# EasyEDA Pro project IronBen_核心板.epro

# Schematic Schematic2
Board Name: 笨笨专用; Create Date: 2025-01-12; Page Name: P1; Project Name: STM32F407VET6; Schematic Name: Schematic2; Update Date: 2025-06-20; Company: 嘉立创EDA; Page Size: A4; Version: V1.0
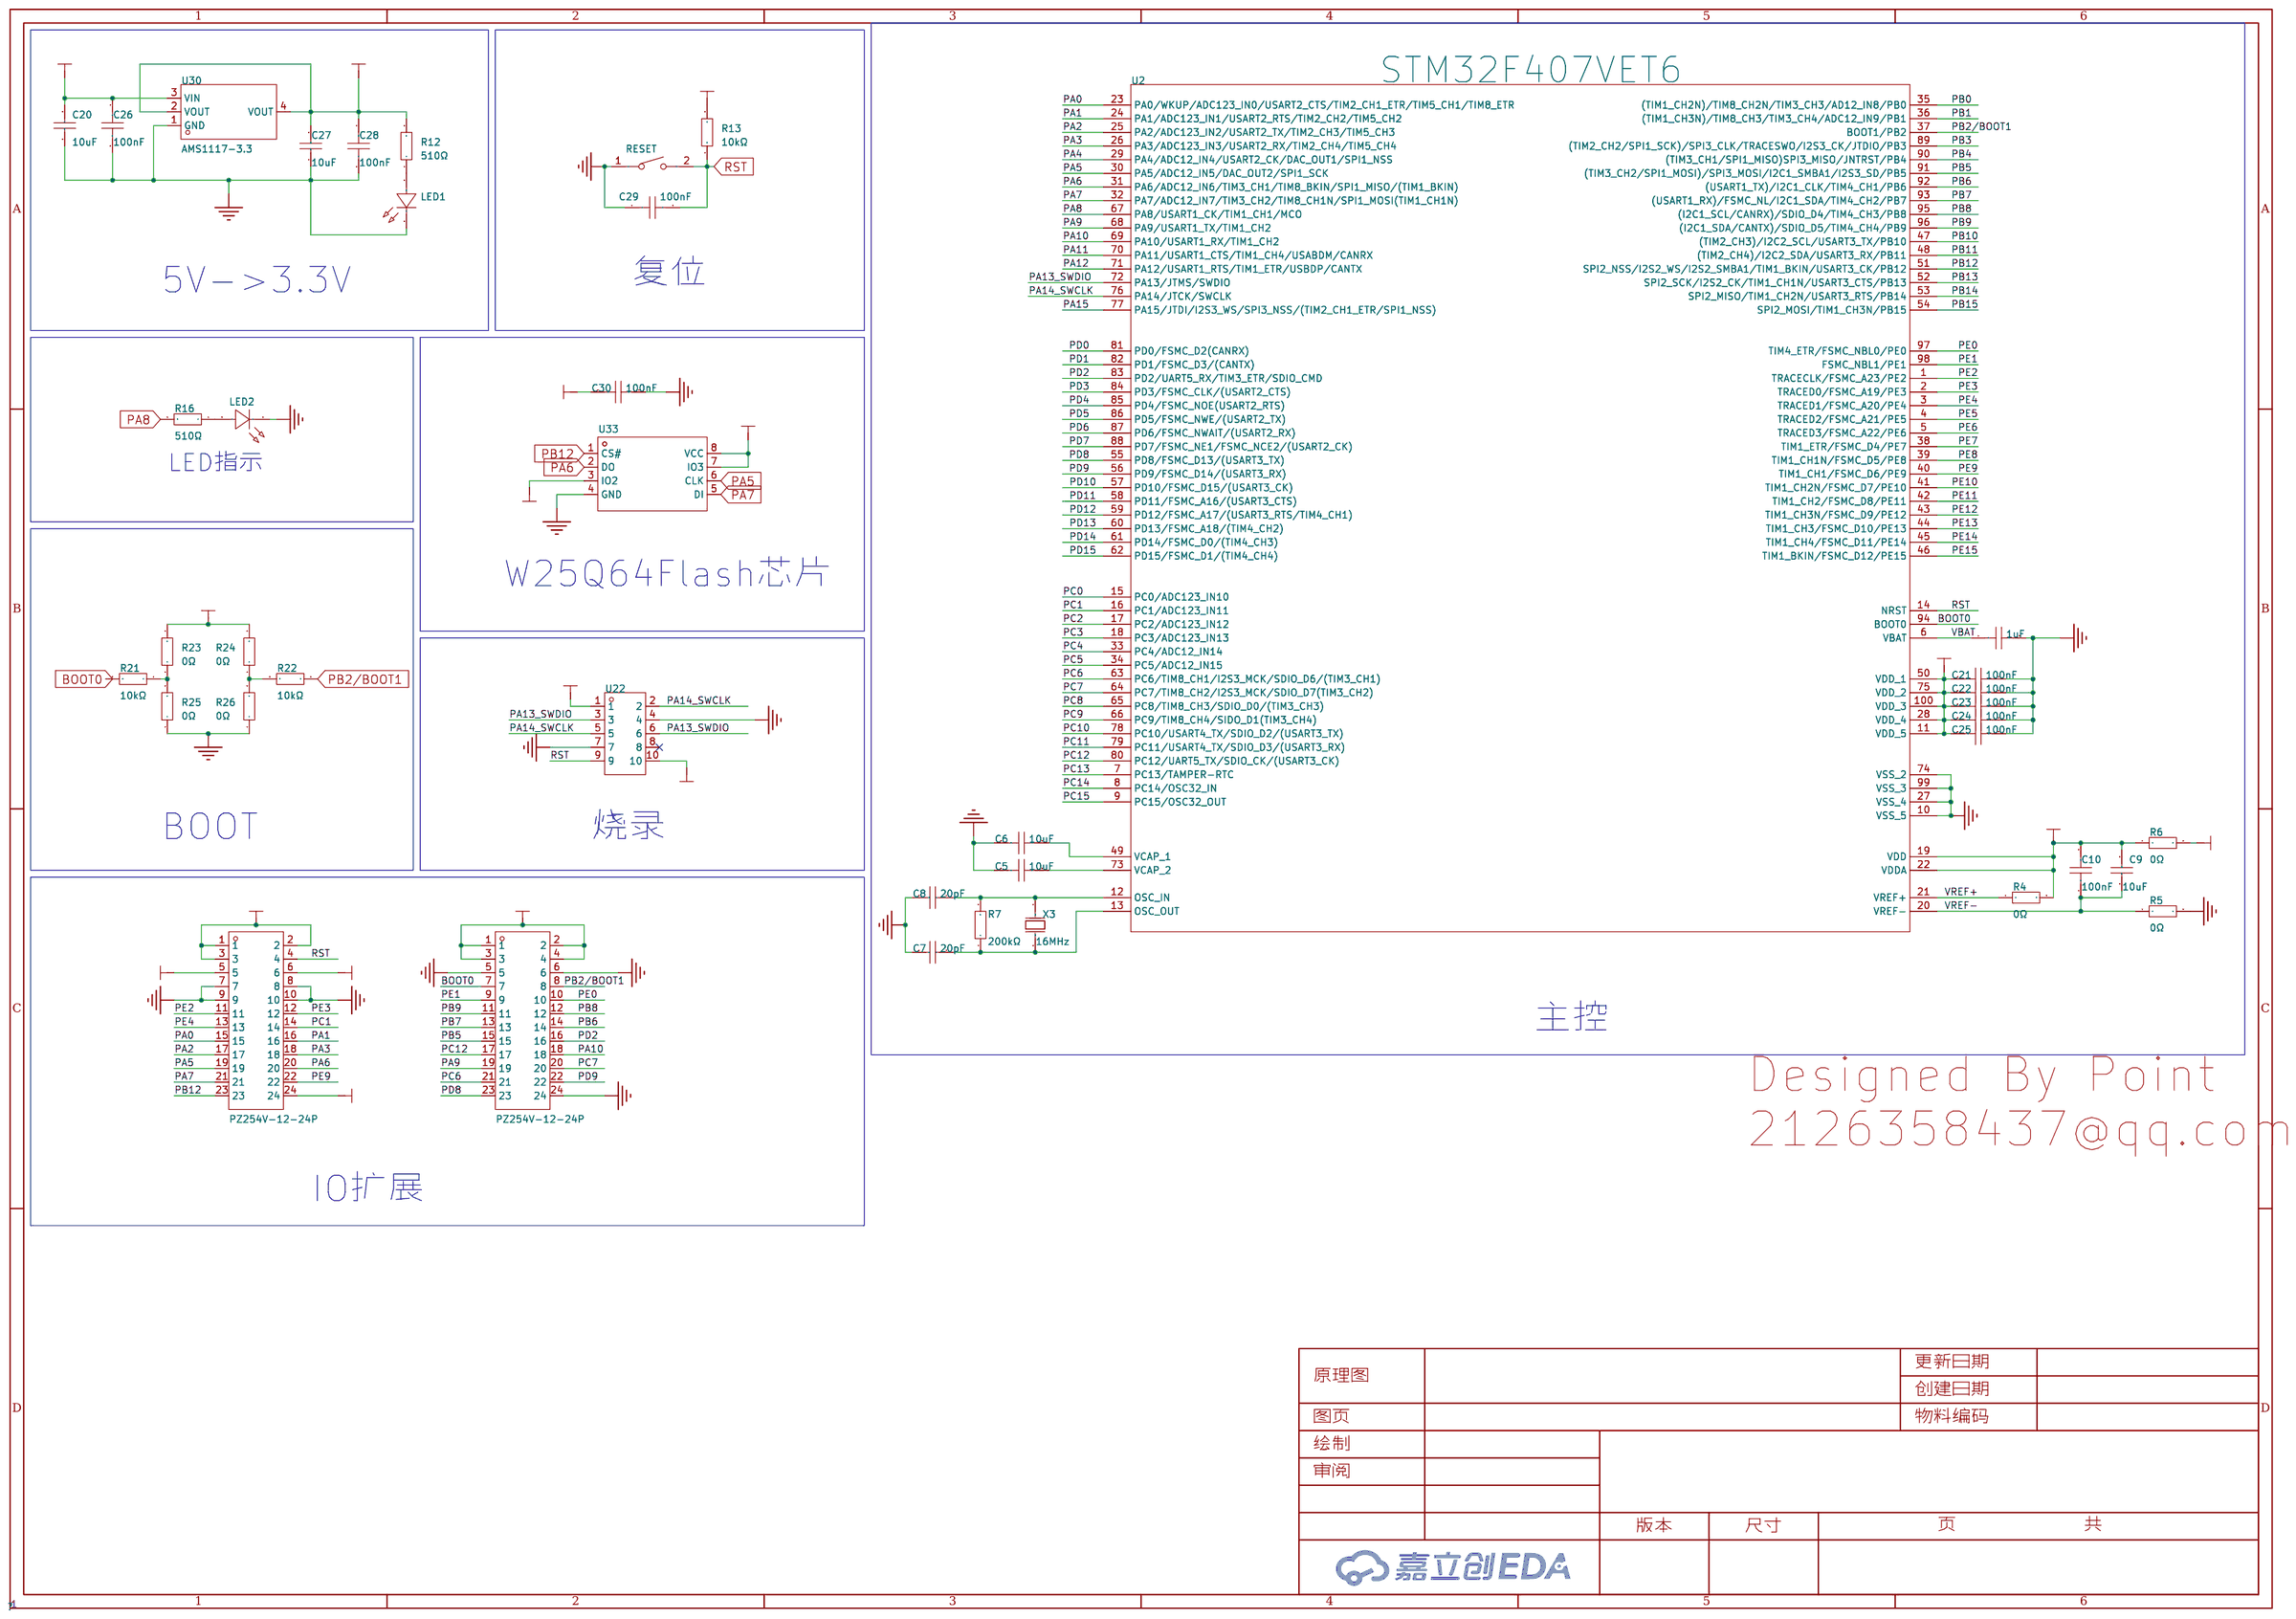
[diagram p0: schematic sheet]

## Parts
C5  10uF  [C0603]
C6  10uF  [C0603]
C7  20pF  [C0603]
C8  20pF  [C0603]
C9  10uF  [C0805]
C10  100nF  [C0603]
C11  1uF  [C0603]
C20  10uF  [C0805]
C21  100nF  [C0603]
C22  100nF  [C0603]
C23  100nF  [C0603]
C24  100nF  [C0603]
C25  100nF  [C0603]
C26  100nF  [C0603]
C27  10uF  [C0805]
C28  100nF  [C0603]
C29  100nF  [C0603]
C30  100nF  [C0603]
H6  PZ254V-12-24P  [HDR-TH_24P-P2.54-V-M-R2-C12-S2.54]
H7  PZ254V-12-24P  [HDR-TH_24P-P2.54-V-M-R2-C12-S2.54]
LED1  XL-1608SURC-06  [LED0603-RD_RED]
LED2  XL-1608SURC-06  [LED0603-RD_RED]
R4  0Ω  [R0603]
R5  0Ω  [R0603]
R6  0Ω  [R0603]
R7  200kΩ  [R0603]
R12  510Ω  [R0603]
R13  10kΩ  [R0603]
R16  510Ω  [R0603]
R21  10kΩ  [R0603]
R22  10kΩ  [R0603]
R23  0Ω  [R0603]
R24  0Ω  [R0603]
R25  0Ω  [R0603]
R26  0Ω  [R0603]
RESET  TS-1088-AR02016  [SW-SMD_L3.9-W3.0-P4.45]
U2  STM32F407VET6  [LQFP-100_L14.0-W14.0-P0.50-LS16.0-BL]
U22  ZX-PZ2.54-2-5PZZ  [HDR-TH_10P-P2.54-V-M-R2-C5-S2.54]
U30  AMS1117-3.3  [SOT-223-3_L6.5-W3.4-P2.30-LS7.0-BR]
U33  W25Q64JVSSIQ  [SOP-8_L5.3-W5.3-P1.27-LS8.0-BL]
X3  16MHz  [OSC-TH_L10.0-W4.5-P5.00]

## Library data of the parts
C5 C6 = CL10A106KP8NNNC: 容值:10uF;精度:±10%;额定电压:10V;材质(温度系数):X5R;; LCSC Part Name: 10uF ±10% 10V; Supplier Part: C19702; Manufacturer: SAMSUNG(三星); Supplier Footprint: 0603; JLCPCB Part Class: 基础库; Datasheet: https://atta.szlcsc.com/upload/public/pdf/source/20160218/1457707763339.pdf; Supplier: LCSC; Tolerance: ±10%; Voltage Rated: 10V; Temperature Coefficient: X5R
C7 C8 = CL10C200JB8NNNC: 容值:20pF;精度:±5%;额定电压:50V;材质(温度系数):C0G;; LCSC Part Name: 20pF ±5% 50V; Supplier Part: C1648; Manufacturer: SAMSUNG(三星); Supplier Footprint: 0603; JLCPCB Part Class: 基础库; Datasheet: https://atta.szlcsc.com/upload/public/pdf/source/20160218/1457707763339.pdf; Supplier: LCSC; Tolerance: ±5%; Voltage Rated: 50V; Temperature Coefficient: C0G
C9 C20 C27 = CL21A106KPFNNNE: 容值:10uF;精度:±10%;额定电压:10V;材质(温度系数):X5R;; LCSC Part Name: 10uF ±10% 10V; Supplier Part: C17024; Manufacturer: SAMSUNG(三星); Supplier Footprint: 0805; JLCPCB Part Class: 扩展库; Datasheet: https://atta.szlcsc.com/upload/public/pdf/source/20160218/1457707763339.pdf; Supplier: LCSC; Tolerance: ±10%; Voltage Rated: 10V; Temperature Coefficient: X5R
C10 C21-C26 C28-C30 = CC0603KRX7R9BB104: 容值:100nF;精度:±10%;额定电压:50V;材质(温度系数):X7R;; LCSC Part Name: 100nF ±10% 50V; Supplier Part: C14663; Manufacturer: YAGEO(国巨); Supplier Footprint: 0603; JLCPCB Part Class: 基础库; Datasheet: https://atta.szlcsc.com/upload/public/pdf/source/20180910/C282072_33301C7F631E79921B82A8DAC6BCC5B3.pdf; Supplier: LCSC; Tolerance: ±10%; Voltage Rated: 50V; Temperature Coefficient: X7R
C11 = CL10A105KB8NNNC: 容值:1uF;精度:±10%;额定电压:50V;材质(温度系数):X5R;; LCSC Part Name: 1uF ±10% 50V; Supplier Part: C15849; Manufacturer: SAMSUNG(三星); Supplier Footprint: 0603; JLCPCB Part Class: 基础库; Datasheet: https://atta.szlcsc.com/upload/public/pdf/source/20160218/1457707763339.pdf; Supplier: LCSC; Tolerance: ±10%; Voltage Rated: 50V; Temperature Coefficient: X5R
H6 H7 = PZ254V-12-24P: 插针结构:2x12P;间距:2.54mm;行距:2.54mm;圆针/方针:方针;安装类型:直插;排数:双排;总PIN位数:24P;额定电流:-;额定电压:-;配合针长度:6mm;塑高:2.5mm;端接针长度:3mm;触头材质:黄铜;触头镀层:-;工作温度范围:-40℃~+105℃;颜色:黑色;; LCSC Part Name: 间距:2.54mm 2x12P 直插 方针; Supplier Part: C492429; Manufacturer: XFCN(兴飞); Supplier Footprint: 插件,P=2.54mm; JLCPCB Part Class: 扩展库; Datasheet: https://atta.szlcsc.com/upload/public/pdf/source/20200309/C492429_A90DEF30FD4D9CDC2C3DDFC5EAF9C00B.pdf; Supplier: LCSC; Pin Structure: 2x12P; Pitch: 2.54mm; Row Spacing: 2.54mm; Circluar Pins/Square Pins: 方针; Mounting Type: 直插; Number of Rows: 双排; Number of Pins: 24P; Length of Mating Pin: 6mm; Insulation Height: 2.5mm; Length of End Connection Pin: 3mm; Contact Material: 黄铜; Operating Temperature Range: -40℃~+105℃; Color: 黑色
LED1 LED2 = XL-1608SURC-06: 发光颜色:红色;功率:55mW;正向电流:25mA;主波长:617nm~621nm;透镜颜色:无色透明透镜;色温:-;发光角度:120°;载带方式:正贴;工作温度:-30℃~+85℃;; Supplier Part: C965799; Manufacturer: XINGLIGHT(成兴光); Supplier Footprint: 0603; JLCPCB Part Class: 扩展库; Datasheet: https://atta.szlcsc.com/upload/public/pdf/source/20221102/D860AFDD1CDB02C5A8064103A32707E2.pdf; Supplier: LCSC; Emitted Color: 红色; Power Dissipation: 55mW; Forward Current: 25mA; Dominant Wavelength: 617nm~621nm; Peak Wavelength: 623nm; Lens Color: 无色透明透镜; Viewing Angle: 120°; Mounting Sytle: 正贴; Operating Temperature: -30℃~+85℃
R4-R6 R23-R26 = 0603WAF0000T5E: 电阻类型:厚膜电阻;阻值:0Ω;精度:±1%;功率:100mW;最大工作电压:75V;; LCSC Part Name: 0Ω ±1% 100mW 厚膜电阻; Supplier Part: C21189; Manufacturer: UNI-ROYAL(厚声); Supplier Footprint: 0603; JLCPCB Part Class: 基础库; Datasheet: https://atta.szlcsc.com/upload/public/pdf/source/20200306/C422600_1E6D84923E4A46A82E41ADD87F860B5C.pdf; Supplier: LCSC; Type: 厚膜电阻; Tolerance: ±1%; Power(Watts): 100mW; Overload Voltage (Max): 75V; Operating Temperature Range: -55℃~+155℃
R7 = 0603WAF2003T5E: 电阻类型:厚膜电阻;阻值:200kΩ;精度:±1%;功率:100mW;最大工作电压:75V;温度系数:±100ppm/℃;; LCSC Part Name: 200kΩ ±1% 100mW 厚膜电阻; Supplier Part: C25811; Manufacturer: UNI-ROYAL(厚声); Supplier Footprint: 0603; JLCPCB Part Class: 基础库; Datasheet: https://atta.szlcsc.com/upload/public/pdf/source/20200306/C422600_1E6D84923E4A46A82E41ADD87F860B5C.pdf; Supplier: LCSC; Type: 厚膜电阻; Tolerance: ±1%; Power(Watts): 100mW; Overload Voltage (Max): 75V; Temperature Coefficient: ±100ppm/℃; Operating Temperature Range: -55℃~+155℃
R12 R16 = 0603WAF5100T5E: 电阻类型:厚膜电阻;阻值:510Ω;精度:±1%;功率:100mW;最大工作电压:75V;温度系数:±100ppm/℃;; LCSC Part Name: 510Ω ±1% 100mW 厚膜电阻; Supplier Part: C23193; Manufacturer: UNI-ROYAL(厚声); Supplier Footprint: 0603; JLCPCB Part Class: 基础库; Datasheet: https://atta.szlcsc.com/upload/public/pdf/source/20200306/C422600_1E6D84923E4A46A82E41ADD87F860B5C.pdf; Supplier: LCSC; Type: 厚膜电阻; Tolerance: ±1%; Power(Watts): 100mW; Overload Voltage (Max): 75V; Temperature Coefficient: ±100ppm/℃; Operating Temperature Range: -55℃~+155℃
R13 R21 R22 = 0603WAF1002T5E: 电阻类型:厚膜电阻;阻值:10kΩ;精度:±1%;功率:100mW;最大工作电压:75V;温度系数:±100ppm/℃;; LCSC Part Name: 厚膜电阻 10kΩ ±1% 100mW; Supplier Part: C25804; Manufacturer: UNI-ROYAL(厚声); Supplier Footprint: 0603; JLCPCB Part Class: 基础库; Datasheet: https://atta.szlcsc.com/upload/public/pdf/source/20200306/C422600_1E6D84923E4A46A82E41ADD87F860B5C.pdf; Supplier: LCSC; Type: 厚膜电阻; Tolerance: ±1%; Power(Watts): 100mW; Overload Voltage (Max): 75V; Temperature Coefficient: ±100ppm/℃; Operating Temperature Range: -55℃~+155℃
RESET = TS-1088-AR02016: 电路结构:单刀单掷;按钮形状:圆形按钮;作用力:160gf;安装方式:立贴;开关长度:4mm;开关宽度:3mm;开关高度:2mm;带支架:不带;触点电流:50mA;额定电压(DC):12V;绝缘电阻:100MΩ;机械寿命:10万次;; LCSC Part Name: 4*3*2mm 立贴 轻触开关; Supplier Part: C720477; Manufacturer: XUNPU(讯普); Supplier Footprint: SMD; JLCPCB Part Class: 扩展库; Datasheet: https://atta.szlcsc.com/upload/public/pdf/source/20200810/C720475_60D09DD6C54279ADDB2DC25100F1CC11.pdf; Supplier: LCSC; Circuit: 单刀单掷; Actuator Style: 圆形按钮; Operating Force: 160gf; Mounting Style: 立贴; Switch Length: 4mm; Switch Width: 3mm; Switch Height: 2mm; Strike Gundam: 不带; Contact Current: 50mA; Voltage Rating (DC): 12V; Insulation Resistance: 100MΩ; Actuator/Cap Color: 黑色; Pin Style: SMD接片; Mechanical Life: 10万次; Operating Temperature: -30℃~+80℃
U2 = STM32F407VET6: tags: STM32; Supplier Part: C28730; Supplier: LCSC; Manufacturer: ST; image: http://image.lceda.cn/szlcsc/C28730.jpg; JLCPCB Part Class: Basic
U22 = ZX-PZ2.54-2-5PZZ: 插针结构:2x5P;间距:2.54mm;行距:2.54mm;圆针/方针:方针;安装类型:直插;排数:双排;总PIN位数:10P;额定电流:3A;额定电压:1kV;配合针长度:6mm;塑高:2.5mm;端接针长度:3mm;触头材质:黄铜;触头镀层:金;工作温度范围:-40℃~+105℃;焊接温度(最大值):-;颜色:黑色;; LCSC Part Name: 2x5P 间距:2.54mm 方针 直插; Supplier Part: C7501276; Manufacturer: Megastar(兆星); Supplier Footprint: 插件,P=2.54mm; JLCPCB Part Class: 扩展库; Datasheet: https://atta.szlcsc.com/upload/public/pdf/source/20231122/7DD2FA5A7FDBC10CDDB6051CB6BC6AD1.pdf; Supplier: LCSC; Pin Structure: 2x5P; Pitch: 2.54mm; Row Spacing: 2.54mm; Circluar Pins/Square Pins: 方针; Mounting Type: 直插; Number of Rows: 双排; Number of Pins: 10P; Current Rating (Max): 3A; Voltage Rating (Max): 1kV; Length of Mating Pin: 6mm; Insulation Height: 2.5mm; Length of End Connection Pin: 3mm; Contact Material: 黄铜; Contact Plating: 金; Operating Temperature Range: -40℃~+105℃; Color: 黑色
U30 = AMS1117-3.3_C6186: 输出类型:固定;最大输入电压:-;输出电压:3.3V;最大输出电流:1A;电源纹波抑制比(PSRR):72dB@(120Hz);输出极性:正极;; LCSC Part Name: 输出3.3V 1A; Supplier Part: C6186; Manufacturer: AMS; Supplier Footprint: SOT-223; JLCPCB Part Class: 基础库; Datasheet: https://atta.szlcsc.com/upload/public/pdf/source/20180727/C6186_7A095716F0823C02F1997A905E26C086.pdf; Supplier: LCSC; Output Type: 固定; Output Voltage: 3.3V; MAX Output Current: 1A; Power Supply Rejection Ratio (PSRR): 72dB@(120Hz); Dropout Voltage: 1.3V@(800mA); Output Polarity: 正极; Number of Outputs: 1
U33 = W25Q64JVSSIQ_C83140: 64M-bit/8M-byte FLASH芯片,SPI接口 133MHz(266/532MHz Dual/Quad-SPI) 比W25Q64FVSSIG更高速度; Supplier Part: C83140; Manufacturer: WINBOND(华邦); Supplier Footprint: SOP-8-208mil; JLCPCB Part Class: 扩展库; Datasheet: https://atta.szlcsc.com/upload/public/pdf/source/20161110/1478742546019.pdf; Supplier: LCSC
X3 = X49SD16MSD2SC: 晶振类型:直插晶振;频率:16MHz;常温频差:±20ppm;外接负载电容:20pF;频率稳定度(全温):±30ppm;; LCSC Part Name: 16MHz ±20ppm 20pF; Supplier Part: C16212; Manufacturer: YXC(扬兴晶振); Supplier Footprint: HC-49S; JLCPCB Part Class: 扩展库; Datasheet: https://atta.szlcsc.com/upload/public/pdf/source/20240329/977D7F2434F98B2BE33270BB9FF3D86D.pdf; Supplier: LCSC; Crystal Type: 直插晶振; Normal temperature Frequency Tolerance: ±20ppm; External load capacitor: 20pF; Frequency Stability(Full temperature range): ±30ppm; Operating Temperature: -20℃~+70℃

## Nets
3V3: C21.2 C22.2 C23.2 C24.2 C25.2 C27.2 C28.1 C30.1 H6.5 H6.6 H7.1 H7.2 H7.3 H7.4 R6.2 R12.2 R13.2 R23.2 R24.2 U2.11(VDD_5) U2.28(VDD_4) U2.50(VDD_1) U2.75(VDD_2) U2.100(VDD_3) U22.1 U30.2(VOUT) U30.4(VOUT) U33.3(IO2) U33.7(IO3) U33.8(VCC)
5V: C20.2 C26.1 H6.1 H6.2 H6.3 H6.24 U22.10 U30.3(VIN)
GND: C5.2 C6.2 C7.2 C8.2 C11.2 C20.1 C21.1 C22.1 C23.1 C24.1 C25.1 C26.2 C27.1 C28.2 C29.1 C30.2 H6.7 H6.8 H6.9 H6.10 H7.5 H7.6 H7.24 LED1.1(K) LED2.1(K) R5.2 R25.1 R26.1 RESET.1 U2.10(VSS_5) U2.27(VSS_4) U2.74(VSS_2) U2.99(VSS_3) U22.4 U22.7 U30.1(GND) U33.4(GND)
VBAT: C11.1 U2.6(VBAT)
VDDA: C9.2 C10.2 R4.2 R6.1 U2.19(VDD) U2.22(VDDA)
BOOT0: H7.7 R21.2 U2.94(BOOT0)
PA0: H6.15 U2.23(PA0/WKUP/ADC123_IN0/USART2_CTS/TIM2_CH1_ETR/TIM5_CH1/TIM8_ETR)
PA1: H6.16 U2.24(PA1/ADC123_IN1/USART2_RTS/TIM2_CH2/TIM5_CH2)
PA2: H6.17 U2.25(PA2/ADC123_IN2/USART2_TX/TIM2_CH3/TIM5_CH3)
PA3: H6.18 U2.26(PA3/ADC123_IN3/USART2_RX/TIM2_CH4/TIM5_CH4)
PA4: U2.29(PA4/ADC12_IN4/USART2_CK/DAC_OUT1/SPI1_NSS)
PA5: H6.19 U2.30(PA5/ADC12_IN5/DAC_OUT2/SPI1_SCK) U33.6(CLK)
PA6: H6.20 U2.31(PA6/ADC12_IN6/TIM3_CH1/TIM8_BKIN/SPI1_MISO/(TIM1_BKIN)) U33.2(DO)
PA7: H6.21 U2.32(PA7/ADC12_IN7/TIM3_CH2/TIM8_CH1N/SPI1_MOSI(TIM1_CH1N)) U33.5(DI)
PA8: R16.2 U2.67(PA8/USART1_CK/TIM1_CH1/MCO)
PA9: H7.19 U2.68(PA9/USART1_TX/TIM1_CH2)
PA10: H7.18 U2.69(PA10/USART1_RX/TIM1_CH2)
PA11: U2.70(PA11/USART1_CTS/TIM1_CH4/USABDM/CANRX)
PA12: U2.71(PA12/USART1_RTS/TIM1_ETR/USBDP/CANTX)
PA13_SWDIO: U2.72(PA13/JTMS/SWDIO) U22.3 U22.6
PA14_SWCLK: U2.76(PA14/JTCK/SWCLK) U22.2 U22.5
PA15: U2.77(PA15/JTDI/I2S3_WS/SPI3_NSS/(TIM2_CH1_ETR/SPI1_NSS))
PB0: U2.35((TIM1_CH2N)/TIM8_CH2N/TIM3_CH3/AD12_IN8/PB0)
PB1: U2.36((TIM1_CH3N)/TIM8_CH3/TIM3_CH4/ADC12_IN9/PB1)
PB2/BOOT1: H7.8 R22.1 U2.37(BOOT1/PB2)
PB3: U2.89((TIM2_CH2/SPI1_SCK)/SPI3_CLK/TRACESWO/I2S3_CK/JTDIO/PB3)
PB4: U2.90((TIM3_CH1/SPI1_MISO)SPI3_MISO/JNTRST/PB4)
PB5: H7.15 U2.91((TIM3_CH2/SPI1_MOSI)/SPI3_MOSI/I2C1_SMBA1/I2S3_SD/PB5)
PB6: H7.14 U2.92((USART1_TX)/I2C1_CLK/TIM4_CH1/PB6)
PB7: H7.13 U2.93((USART1_RX)/FSMC_NL/I2C1_SDA/TIM4_CH2/PB7)
PB8: H7.12 U2.95((I2C1_SCL/CANRX)/SDIO_D4/TIM4_CH3/PB8)
PB9: H7.11 U2.96((I2C1_SDA/CANTX)/SDIO_D5/TIM4_CH4/PB9)
PB10: U2.47((TIM2_CH3)/I2C2_SCL/USART3_TX/PB10)
PB11: U2.48((TIM2_CH4)/I2C2_SDA/USART3_RX/PB11)
PB12: H6.23 U2.51(SPI2_NSS/I2S2_WS/I2S2_SMBA1/TIM1_BKIN/USART3_CK/PB12) U33.1(CS#)
PB13: U2.52(SPI2_SCK/I2S2_CK/TIM1_CH1N/USART3_CTS/PB13)
PB14: U2.53(SPI2_MISO/TIM1_CH2N/USART3_RTS/PB14)
PB15: U2.54(SPI2_MOSI/TIM1_CH3N/PB15)
PC0: U2.15(PC0/ADC123_IN10)
PC1: H6.14 U2.16(PC1/ADC123_IN11)
PC2: U2.17(PC2/ADC123_IN12)
PC3: U2.18(PC3/ADC123_IN13)
PC4: U2.33(PC4/ADC12_IN14)
PC5: U2.34(PC5/ADC12_IN15)
PC6: H7.21 U2.63(PC6/TIM8_CH1/I2S3_MCK/SDIO_D6/(TIM3_CH1))
PC7: H7.20 U2.64(PC7/TIM8_CH2/I2S3_MCK/SDIO_D7(TIM3_CH2))
PC8: U2.65(PC8/TIM8_CH3/SDIO_D0/(TIM3_CH3))
PC9: U2.66(PC9/TIM8_CH4/SIDO_D1(TIM3_CH4))
PC10: U2.78(PC10/USART4_TX/SDIO_D2/(USART3_TX))
PC11: U2.79(PC11/USART4_TX/SDIO_D3/(USART3_RX))
PC12: H7.17 U2.80(PC12/UART5_TX/SDIO_CK/(USART3_CK))
PC13: U2.7(PC13/TAMPER-RTC)
PC14: U2.8(PC14/OSC32_IN)
PC15: U2.9(PC15/OSC32_OUT)
PD0: U2.81(PD0/FSMC_D2(CANRX))
PD1: U2.82(PD1/FSMC_D3/(CANTX))
PD2: H7.16 U2.83(PD2/UART5_RX/TIM3_ETR/SDIO_CMD)
PD3: U2.84(PD3/FSMC_CLK/(USART2_CTS))
PD4: U2.85(PD4/FSMC_NOE(USART2_RTS))
PD5: U2.86(PD5/FSMC_NWE/(USART2_TX))
PD6: U2.87(PD6/FSMC_NWAIT/(USART2_RX))
PD7: U2.88(PD7/FSMC_NE1/FSMC_NCE2/(USART2_CK))
PD8: H7.23 U2.55(PD8/FSMC_D13/(USART3_TX))
PD9: H7.22 U2.56(PD9/FSMC_D14/(USART3_RX))
PD10: U2.57(PD10/FSMC_D15/(USART3_CK))
PD11: U2.58(PD11/FSMC_A16/(USART3_CTS))
PD12: U2.59(PD12/FSMC_A17/(USART3_RTS/TIM4_CH1))
PD13: U2.60(PD13/FSMC_A18/(TIM4_CH2))
PD14: U2.61(PD14/FSMC_D0/(TIM4_CH3))
PD15: U2.62(PD15/FSMC_D1/(TIM4_CH4))
PE0: H7.10 U2.97(TIM4_ETR/FSMC_NBL0/PE0)
PE1: H7.9 U2.98(FSMC_NBL1/PE1)
PE2: H6.11 U2.1(TRACECLK/FSMC_A23/PE2)
PE3: H6.12 U2.2(TRACED0/FSMC_A19/PE3)
PE4: H6.13 U2.3(TRACED1/FSMC_A20/PE4)
PE5: U2.4(TRACED2/FSMC_A21/PE5)
PE6: U2.5(TRACED3/FSMC_A22/PE6)
PE7: U2.38(TIM1_ETR/FSMC_D4/PE7)
PE8: U2.39(TIM1_CH1N/FSMC_D5/PE8)
PE9: H6.22 U2.40(TIM1_CH1/FSMC_D6/PE9)
PE10: U2.41(TIM1_CH2N/FSMC_D7/PE10)
PE11: U2.42(TIM1_CH2/FSMC_D8/PE11)
PE12: U2.43(TIM1_CH3N/FSMC_D9/PE12)
PE13: U2.44(TIM1_CH3/FSMC_D10/PE13)
PE14: U2.45(TIM1_CH4/FSMC_D11/PE14)
PE15: U2.46(TIM1_BKIN/FSMC_D12/PE15)
RST: C29.2 H6.4 R13.1 RESET.2 U2.14(NRST) U22.9
VREF+: R4.1 U2.21(VREF+)
VREF-: C9.1 C10.1 R5.1 U2.20(VREF-)
$1N11352: C5.1 U2.73(VCAP_2)
$1N11353: C6.1 U2.49(VCAP_1)
$1N11423: C8.1 R7.2 U2.12(OSC_IN) X3.1(OSC1)
$1N11424: C7.1 R7.1 U2.13(OSC_OUT) X3.2(OSC2)
$1N11608: LED2.2(A) R16.1
$1N16166: R21.1 R23.1 R25.2
$1N16210: R22.2 R24.1 R26.2
Net-(LED1-2): LED1.2(A) R12.1

Not connected (* = marked no-connect by the designer): U22 8*

## Notes on the sheet
- 复位
- 5V->3.3V
- LED指示
- W25Q64Flash芯片
- BOOT
- 烧录
- 主控
- Designed By Point
  2126358437@qq.com
- IO扩展

# Board PCB3
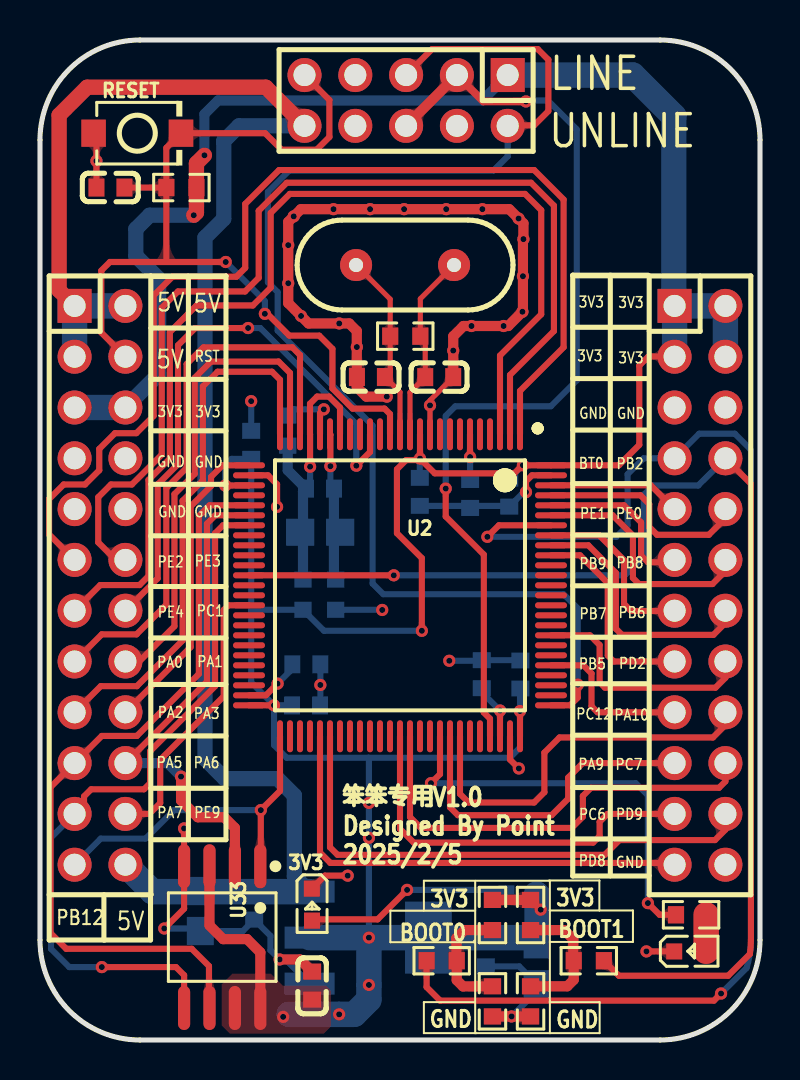
[diagram p1: board, top side]
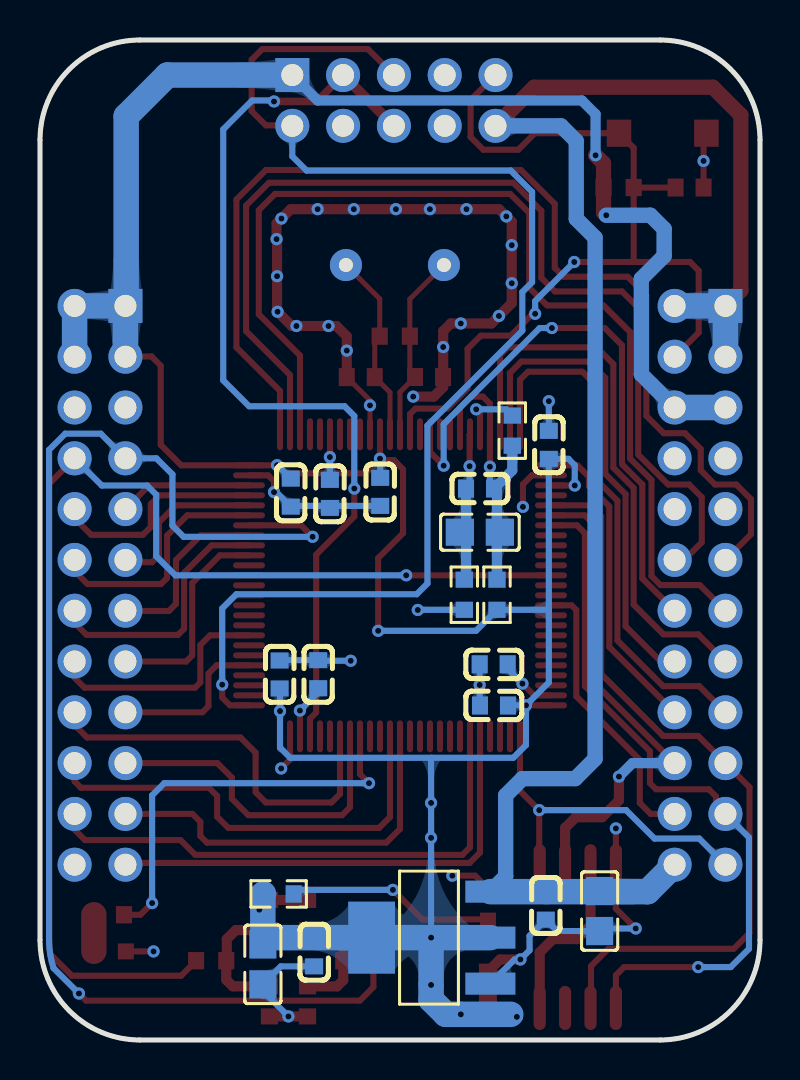
[diagram p2: board, bottom side, seen from below]

Outline 36 x 50 mm; copper layers: Top Layer, Bottom Layer. Coordinates in mm from the lower left corner of the outline.
Outline path: 0,45 0,5 arc(1.46,1.46) 5,0 31,0 arc(34.54,1.46) 36,5 36,45 arc(34.54,48.54) 31,50 5,50 arc(1.46,48.54) 0,45
Stack: Top Layer 0.035mm / Dielectric1 1.51mm FR4 er 4.5 / Bottom Layer 0.035mm

## Design rules (mm)
net $1N11424: DP1
net $1N11423: DP1
template: JLCPCB Capability(Two Layers Board)
spacing copperThickness1oz (default): track to track 0.102, other pairs 0.152 to 0.3
spacing copperThickness2oz: track to track 0.203, other pairs 0.152 to 0.3
track width copperThickness1oz (default): min 0.127, default 0.254, max 2.54
track width copperThickness2oz: min 0.203, default 0.254, max 2.54
differential pair differentialPair (default): width min 0.127, default 0.254, max 2.54; gap min 0.152, default 0.152
via viaSize (default): diameter min 0.5, default 0.61, max 10; hole min 0.3, default 0.305, max 6.3

## Placement (name value [footprint] x y rotation side)
3V3  XL-1608SURC-06  [LED0603-RD_RED]  13.6 6.77 270 top
C5  10uF  [C0603]  22.09 18.29 90 bottom
C6  10uF  [C0603]  13.32 18.78 0 bottom
C7  20pF  [C0603]  16.55 33.15 180 top
C8  20pF  [C0603]  19.96 33.14 0 top
C9  10uF  [C0805]  14.01 25.39 180 bottom
C10  100nF  [C0603]  14 27.57 180 bottom
C11  1uF  [C0603]  21.51 27.3 270 bottom
C20  10uF  [C0805]  8.02 6.45 90 bottom
C21  100nF  [C0603]  13.3 16.73 180 bottom
C22  100nF  [C0603]  24.02 18.28 270 bottom
C23  100nF  [C0603]  23.46 27.37 90 bottom
C24  100nF  [C0603]  10.56 29.76 270 bottom
C25  100nF  [C0603]  18.99 27.41 90 bottom
C26  100nF  [C0603]  10.71 6.72 270 bottom
C27  10uF  [C0805]  24.86 3.78 90 bottom
C28  100nF  [C0603]  22.29 4.38 270 bottom
C29  100nF  [C0603]  3.52 42.62 0 top
C30  100nF  [C0603]  13.61 2.72 90 top
H6  PZ254V-12-24P  [HDR-TH_24P-P2.54-V-M-R2-C12-S2.54]  3 22.73 270 top
H7  PZ254V-12-24P  [HDR-TH_24P-P2.54-V-M-R2-C12-S2.54]  33 22.73 270 top
LED2  XL-1608SURC-06  [LED0603-RD_RED]  32.51 4.43 0 top
R4  0Ω  [R0603]  12.39 30.47 270 bottom
R5  0Ω  [R0603]  14.78 22.26 270 bottom
R6  0Ω  [R0603]  13.15 22.26 270 bottom
R7  200kΩ  [R0603]  18.26 35.19 0 top
R12  510Ω  [R0603]  24.07 7.3 0 bottom
R13  10kΩ  [R0603]  7.07 42.62 0 top
R16  510Ω  [R0603]  32.55 6.26 180 top
R21  10kΩ  [R0603]  20.08 3.96 180 top
R22  10kΩ  [R0603]  27.44 3.96 180 top
R23  0Ω  [R0603]  22.62 6.25 90 top
R24  0Ω  [R0603]  24.53 6.25 90 top
R25  0Ω  [R0603]  22.62 1.93 90 top
R26  0Ω  [R0603]  24.53 1.93 90 top
RESET  TS-1088-AR02016  [SW-SMD_L3.9-W3.0-P4.45]  4.87 45.34 0 top
U2  STM32F407VET6  [LQFP-100_L14.0-W14.0-P0.50-LS16.0-BL]  18 22.73 180 top
U22  ZX-PZ2.54-2-5PZZ  [HDR-TH_10P-P2.54-V-M-R2-C5-S2.54]  18.31 46.98 180 top
U30  AMS1117-3.3  [SOT-223-3_L6.5-W3.4-P2.30-LS7.0-BR]  16.45 5.12 180 bottom
U33  W25Q64JVSSIQ  [SOP-8_L5.3-W5.3-P1.27-LS8.0-BL]  9.11 5.14 180 top
X3  16MHz  [OSC-TH_L10.0-W4.5-P5.00]  18.25 38.75 270 top

## Footprints (pads in the part's own frame, mm; a bottom-side part is the same pattern mirrored in y, then rotated)
C0603
  rect 0.8x0.9 smd: 1(-0.7,0) 2(0.7,0)
C0805
  rect 1.41x1.35 smd: 1(-1,0) 2(1,0)
HDR-TH_10P-P2.54-V-M-R2-C5-S2.54
  rect 1.7x1.7 hole 1.1: 1(-5.08,-1.27)
  round 1.7 hole 1.1: 2(-5.08,1.27) 3(-2.54,-1.27) 4(-2.54,1.27) 5(0,-1.27) 6(0,1.27) 7(2.54,-1.27) 8(2.54,1.27) 9(5.08,-1.27) 10(5.08,1.27)
HDR-TH_24P-P2.54-V-M-R2-C12-S2.54
  rect 1.7x1.7 hole 1.1: 1(-13.97,-1.27)
  round 1.7 hole 1.1: 2(-13.97,1.27) 3(-11.43,-1.27) 4(-11.43,1.27) 5(-8.89,-1.27) 6(-8.89,1.27) 7(-6.35,-1.27) 8(-6.35,1.27) 9(-3.81,-1.27) 10(-3.81,1.27) 11(-1.27,-1.27) 12(-1.27,1.27) 13(1.27,-1.27) 14(1.27,1.27) 15(3.81,-1.27) 16(3.81,1.27) 17(6.35,-1.27) 18(6.35,1.27) 19(8.89,-1.27) 20(8.89,1.27) 21(11.43,-1.27) 22(11.43,1.27) 23(13.97,-1.27) 24(13.97,1.27)
LED0603-RD_RED
  rect 0.8x0.8 smd: 1(-0.799,-0.004) 2(0.799,0.004)
LQFP-100_L14.0-W14.0-P0.50-LS16.0-BL
  oval 0.3x1.6 smd: 1(-6,-7.55) 2(-5.5,-7.55) 3(-5,-7.55) 4(-4.5,-7.55) 5(-4,-7.55) 6(-3.5,-7.55) 7(-3,-7.55) 8(-2.5,-7.55) 9(-2,-7.55) 10(-1.5,-7.55) 11(-1,-7.55) 12(-0.5,-7.55) 13(0,-7.55) 14(0.5,-7.55) 15(1,-7.55) 16(1.5,-7.55) 17(2,-7.55) 18(2.5,-7.55) 19(3,-7.55) 20(3.5,-7.55) 21(4,-7.55) 22(4.5,-7.55) 23(5,-7.55) 24(5.5,-7.55) 25(6,-7.55) 51(6,7.55) 52(5.5,7.55) 53(5,7.55) 54(4.5,7.55) 55(4,7.55) 56(3.5,7.55) 57(3,7.55) 58(2.5,7.55) 59(2,7.55) 60(1.5,7.55) 61(1,7.55) 62(0.5,7.55) 63(0,7.55) 64(-0.5,7.55) 65(-1,7.55) 66(-1.5,7.55) 67(-2,7.55) 68(-2.5,7.55) 69(-3,7.55) 70(-3.5,7.55) 71(-4,7.55) 72(-4.5,7.55) 73(-5,7.55) 74(-5.5,7.55) 75(-6,7.55)
  oval 1.6x0.3 smd: 26(7.55,-6) 27(7.55,-5.5) 28(7.55,-5) 29(7.55,-4.5) 30(7.55,-4) 31(7.55,-3.5) 32(7.55,-3) 33(7.55,-2.5) 34(7.55,-2) 35(7.55,-1.5) 36(7.55,-1) 37(7.55,-0.5) 38(7.55,0) 39(7.55,0.5) 40(7.55,1) 41(7.55,1.5) 42(7.55,2) 43(7.55,2.5) 44(7.55,3) 45(7.55,3.5) 46(7.55,4) 47(7.55,4.5) 48(7.55,5) 49(7.55,5.5) 50(7.55,6) 76(-7.55,6) 77(-7.55,5.5) 78(-7.55,5) 79(-7.55,4.5) 80(-7.55,4) 81(-7.55,3.5) 82(-7.55,3) 83(-7.55,2.5) 84(-7.55,2) 85(-7.55,1.5) 86(-7.55,1) 87(-7.55,0.5) 88(-7.55,0) 89(-7.55,-0.5) 90(-7.55,-1) 91(-7.55,-1.5) 92(-7.55,-2) 93(-7.55,-2.5) 94(-7.55,-3) 95(-7.55,-3.5) 96(-7.55,-4) 97(-7.55,-4.5) 98(-7.55,-5) 99(-7.55,-5.5) 100(-7.55,-6)
OSC-TH_L10.0-W4.5-P5.00
  round 1.6 hole 0.7: 1(0,2.45) 2(0,-2.45)
R0603
  rect 0.806x0.864 smd: 1(-0.753,0) 2(0.753,0)
SOP-8_L5.3-W5.3-P1.27-LS8.0-BL
  oval 0.609x2.204 smd: 1(-1.905,-3.542) 2(-0.635,-3.542) 3(0.635,-3.542) 4(1.905,-3.542) 5(1.905,3.542) 6(0.635,3.542) 7(-0.635,3.542) 8(-1.905,3.542)
SOT-223-3_L6.5-W3.4-P2.30-LS7.0-BR
  rect 2.5x1.1 smd: 1(2.97,-2.3) 2(2.97,0) 3(2.97,2.3)
  rect 2.34x3.6 smd: 4(-2.97,0)
SW-SMD_L3.9-W3.0-P4.45
  rect 1.23x1.36 smd: 1(-2.185,0) 2(2.185,0)

## Nets
As in the schematic, except:
GND: 3V3.1 C5.2 C6.2 C7.2 C8.2 C11.2 C20.1 C21.1 C22.1 C23.1 C24.1 C25.1 C26.2 C27.1 C28.2 C29.1 C30.2 H6.7 H6.8 H6.9 H6.10 H7.5 H7.6 H7.24 LED2.1 R5.2 R25.1 R26.1 RESET.1 U2.10 U2.27 U2.74 U2.99 U22.4 U22.7 U30.1 U33.4
$1N11440: 3V3.2 R12.1

Pads without a net: U22 8

## Via types
v1: diameter 0.61, hole 0.305, Top Layer to Bottom Layer, 71 vias

## Routing (per net, layer and track width the routed paths; a pad name or vN(x,y) marks a point on that pad's centre or on a via; arc(x,y) is an arc through that point)
3V3: length 182.7
  Top Layer w0.305: v1(19,29.07) 18.92,28.99 18.31,28.99 17.85,28.54 17.85,25.34 19.09,24.09 v1(19.09,20.46) ; v1(19,29.07) U2.11 ; v1(19,29.07) 19.74,28.33 23.72,28.33 24.12,28.74 v1(24.15,28.74) 24.15,28.73 U2.100 28.94,28.73 29.96,29.76 29.96,33.72 30.42,34.18 31.72,34.18 H7.3 ; v1(9.26,27.72) 10.44,27.72 U2.28 ; v1(25.04,6.52) 25.02,6.52 R24.2 ; U2.50 v1(11.7,16.73) ; 24,15.18 v1(24,16.45)
  Top Layer w0.508: 8.48,8.69 8.48,5.73 9.16,5.04 10.35,5.04 11.02,4.38 U33.8 ; R23.2 R24.2
  Top Layer w0.762: v1(8.22,44.23) 7.82,43.84 7.82,41.37 v1(7.69,41.24)
  Bottom Layer w0.305: C25.2 18.99,29.06 v1(19,29.07) ; 16.43,14.11 16.45,14.1 v1(16.45,11.85) v1(16.45,10.11) v1(16.45,5.12) ; 16.43,14.11 12.34,14.11 11.7,14.75 v1(11.7,16.73) ; 16.43,14.11 23.49,14.11 24,14.62 v1(24,16.45) 24,17.56 C22.2 ; v1(24.15,28.74) 24.13,28.74 C23.2 ; 12.6,16.73 12.59,16.73 v1(11.7,16.73) ; v1(19.09,20.46) 14.2,20.46 R6.2 10.57,21.51 10.56,21.52 ; 10.56,21.52 10.56,17.88 v1(11.7,16.73) ; 10.56,21.52 C24.2 9.58,29.06 9.26,28.74 v1(9.26,27.72)
  Bottom Layer w0.508: U22.1 22.12,46.98 8.91,46.98 8.22,46.29 v1(8.22,44.23)
  Bottom Layer w0.762: v1(7.69,41.24) 5.48,41.24 4.79,40.55 4.79,39.21 5.94,38.06 5.94,33.29 H6.6
  Bottom Layer w1.27: H7.1 31.69,36.74 31.69,46.19 29.63,48.25 U22.1 ; H7.1 H7.3 ; H7.1 H7.2 H7.4 ; H6.5 H6.6 ; R12.2 24.86,7.27 C27.2 24.52,5.12 U30.4 v1(16.45,5.12) ; v1(16.45,5.12) U30.2 ; v1(16.45,5.12) v1(16.45,2.75) 16.45,2.02 15.71,1.28 v1(14.96,1.28) 12.46,1.28
  vias: v1(12.16,1.16)
5V: length 84.3
  Top Layer w0.762: U22.10 11.29,47.64 2.35,47.64 0.96,46.24 0.96,37.48 H6.1
  Bottom Layer w0.762: U22.10 9.95,45.71 9.19,44.95 9.19,41.06 8.25,40.12 8.25,14.06 9.24,13.07 11.88,13.07 12.72,12.23 12.72,8.18 U30.3
  Bottom Layer w1.27: U30.3 C26.1 5.62,7.42 4.27,8.76 ; H6.3 H6.1 H6.2
GND: length 90.1
  Top Layer w0.254: U2.10 19.5,31.98 C8.2
  Top Layer w0.305: v1(6.21,5.58) 7.21,6.57 v1(7.21,10.58) ; 3V3.1 14.24,8.22 v1(15.38,8.22) ; LED2.1 v1(30.32,4.43) 30.32,4.43 30.32,4.43 ; 23.5,15.18 23.5,14.02 v1(23.94,13.58) ; U2.99 24.6,28.23 24.3,27.94 v1(24.3,27.39) ; C29.1 v1(2.82,43.95) 2.82,45.34 RESET.1 ; v1(11.85,26.66) 11.85,27.78 11.4,28.23 U2.27
  Top Layer w0.508: 15.84,33.15 v1(15.84,34.65) 15.84,35.45 15.46,35.83 v1(14.96,35.83) 13.43,35.83 v1(13.05,36.2) 12.41,36.84 v1(12.41,37.84) v1(12.41,39.74) 12.41,40.91 v1(12.69,41.18) 13.05,41.54 v1(14.68,41.54) v1(16.51,41.54) v1(18.21,41.54) v1(20.31,41.54) v1(22.12,41.54) 23.46,41.54 v1(23.93,41.07) 24.17,40.83 v1(24.17,40.04) 24.15,40.02 v1(24.15,38.19) 24.15,36.44 v1(24.12,36.41) 23.41,35.7 v1(23.18,35.7) v1(21.57,35.7) 21.18,35.7 20.66,35.19 v1(20.66,34.47) C8.2 ; 15.84,33.15 C7.2 ; 15.84,33.15 15.84,32.64 16.31,32.17 v1(17.34,32.17) ; v1(11.98,4.03) 13,4.03 C30.2 ; R26.1 v1(23.58,1.18) R25.1
  Bottom Layer w0.305: v1(17.11,21.5) 17.1,21.51 R5.2 ; C21.1 14.02,16.74 v1(14.02,17.75) C6.2 ; C24.1 v1(10.56,31.94) ; v1(20.46,18.96) 22.06,18.96 C5.2 24,18.99 C22.1 ; C28.2 23.96,3.68 C27.1 24.86,2.46 v1(23.58,1.18) ; v1(24.3,27.39) 24.19,27.39 C23.1 23.42,26.71 C25.1 ; U30.1 12.27,4.03 v1(11.98,4.03) 11.52,4.48 11.52,5.21 C26.2 10.14,5.45 C20.1 7.89,5.58 v1(6.21,5.58)
  vias: v1(19.5,31.73)
VBAT: length 2.3
  Top Layer w0.305: U2.6 21.5,29.15 v1(21.51,29.15)
  Bottom Layer w0.305: v1(21.51,29.15) C11.1
VDDA: length 14.7
  Top Layer w0.305: v1(13.5,28.66) 13.5,30.28 U2.22 13.5,31.82 13.85,32.17 14.45,32.17 15,31.62 U2.19
  Bottom Layer w0.305: v1(13.5,28.66) 13.5,27.78 C10.2
  Bottom Layer w0.508: R6.1 13.15,27.43 C10.2 12.39,28.48 12.39,29.71
BOOT0: length 64.8
  Top Layer w0.305: v1(22.37,25.16) 22.94,25.73 U2.94 ; v1(34.05,2.32) 33.7,1.97 20.01,1.97 19.33,2.65 R21.2
  Bottom Layer w0.305: v1(34.05,2.32) 35.33,3.6 arc(35.49,4.29) 35.55,5 35.55,29.51 34.74,30.32 32.96,30.32 H7.7 30.18,29.08 29.38,28.28 29.38,25.72 28.82,25.16 v1(22.37,25.16)
PA0: length 28.3
  Top Layer w0.305: U2.23 13,34.25 12.62,34.63 8.17,34.63 7.33,33.8 7.33,28.61 6.32,27.6 6.32,21.77 4.83,20.28 3.09,20.28 H6.15
PA1: length 24.4
  Top Layer w0.305: U2.24 12.5,33.35 11.93,33.92 8.55,33.92 7.74,33.11 7.74,28.31 6.72,27.29 6.72,20.69 4.96,18.92 H6.16
PA2: length 27.1
  Top Layer w0.305: U2.25 12,33.01 11.6,33.41 8.88,33.41 8.15,32.68 8.15,27.98 7.13,26.96 7.13,19.98 4.84,17.69 3.04,17.69 1.73,16.38
PA3: length 15.7
  Top Layer w0.305: U2.26 9.13,28.73 8.55,28.16 8.55,27.7 7.53,26.68 7.53,19.65 4.27,16.38
PA5: length 38.4
  Top Layer w0.305: U33.6 8.45,1.63 8.45,3.7 7.59,4.56 1.31,4.56 0.53,5.35 0.53,12.64 H6.19 3.09,15.2 4.84,15.2 7.94,18.3 7.94,26.2 8.48,26.73 U2.30
PA6: length 25.4
  Top Layer w0.305: U2.31 8.76,26.23 8.35,25.82 8.35,17.92 H6.20
  Top Layer w0.508: v1(7.05,13.17) 7.05,11.98 7.89,11.14 9.21,11.14 9.75,10.61 9.75,8.69
  Bottom Layer w0.508: H6.20 6.38,13.84 v1(7.05,13.17)
PA7: length 36.4
  Top Layer w0.305: U2.32 9.15,25.73 8.75,25.34 8.75,17.69 5.5,14.44 5.5,12.84 5.2,12.54 2.56,12.54 2.2,12.18 2.2,11.78 1.73,11.3 ; U33.5 7.21,3.24 6.8,3.65 v1(3.09,3.65)
  Bottom Layer w0.305: 1.73,11.3 0.55,10.12 0.55,4.56 1.46,3.65 v1(3.09,3.65)
PA8: length 20.7
  Top Layer w0.305: v1(19.55,12.84) 20,13.29 20,15.18 ; R16.2 30.98,6.26 v1(30.4,6.85)
  Bottom Layer w0.305: v1(19.55,12.84) 29.79,12.84 30.4,12.23 v1(30.4,6.85)
PA9: length 16.6
  Top Layer w0.305: 20.5,15.18 20.5,11.64 20.9,11.24 25.58,11.24 26.41,12.06 26.41,13.12 27.13,13.84 H7.19
PA10: length 19.7
  Top Layer w0.305: 34.27,16.38 34.27,15.75 33.65,15.13 25.98,15.13 25.22,14.37 25.22,12.39 24.71,11.88 21.43,11.88 21,12.3 21,15.18
PA13_SWDIO: length 47.5
  Top Layer w0.305: v1(20.29,27.57) 20.29,26.18 22.19,24.27 22.19,16.38 22.5,16.07 22.5,15.18
  Top Layer w0.381: U22.3 22.17,46.93 v1(24.3,46.93)
  Top Layer w0.508: U22.3 U22.6
  Bottom Layer w0.305: v1(24.3,46.93) 24.35,46.98 25.39,46.98 26.84,45.53 26.84,32.98 25.54,31.69 20.77,31.69 20.29,31.2 v1(20.29,27.57)
PA14_SWCLK: length 65.5
  Top Layer w0.305: v1(26.89,17.77) 26.89,17.12 26.5,16.73 U2.76 ; U22.5 19.61,49.55 24.88,49.55 25.42,49.01 25.42,46.44 24.71,45.73 23.41,45.73 U22.2
  Bottom Layer w0.305: U22.2 23.39,44.18 22.67,43.47 12.46,43.47 11.4,42.41 11.4,37.88 11.88,37.4 11.88,35.47 16.63,30.72 16.63,22.82 17.16,22.29 26.18,22.29 26.89,21.58 v1(26.89,17.77)
PB2/BOOT1: length 61.4
  Top Layer w0.305: H7.8 35.55,27.81 35.55,5 arc(35.53,4.65) 35.49,4.3 34.41,3.21 28.94,3.21 R22.1 ; U2.37 v1(17.69,23.23) 17.7,23.23
  Bottom Layer w0.305: v1(17.69,23.23) 29.23,23.23 30.19,24.19 30.19,27.27 30.65,27.72 32.91,27.72 H7.8
PB5: length 10.5
  Top Layer w0.305: H7.15 28.69,18.92 28.39,19.23 28.39,22.85 27,24.23 U2.91
PB6: length 13.1
  Top Layer w0.305: U2.92 27.42,24.73 28.8,23.36 28.8,20.56 29.1,20.26 33.67,20.26 34.27,20.86 34.27,21.46
PB7: length 9
  Top Layer w0.305: 31.73,21.46 31.72,21.45 29.56,21.45 29.2,21.81 29.2,23.99 27.96,25.23 U2.93
PB8: length 12.2
  Top Layer w0.305: U2.95 28.63,26.23 29.65,25.22 29.65,23.1 29.95,22.8 33.62,22.8 34.27,23.45 H7.12
PB9: length 8.4
  Top Layer w0.305: H7.11 31.61,23.89 30.4,23.89 30.05,24.23 30.05,25.88 29.2,26.73 U2.96
PB12: length 17.3
  Top Layer w0.305: 12,15.18 12,12.45 v1(11.04,11.49) 11.04,8.71 11.02,8.69
  Bottom Layer w0.305: v1(11.04,11.49) 6.7,11.49 5.27,10.07 3.04,10.07 1.73,8.76
PC1: length 29.6
  Top Layer w0.305: v1(15.82,28.72) 16.5,29.4 U2.16 ; v1(10.41,35.6) 7.76,35.6 6.9,34.73 6.9,28.79 5.88,27.78 5.88,23.08 4.27,21.46
  Bottom Layer w0.305: v1(15.82,28.72) 15.82,30.8 11.02,35.6 v1(10.41,35.6)
PC6: length 19.7
  Top Layer w0.305: 31.73,11.3 28.38,11.3 27.98,10.91 27.98,10.2 27.65,9.87 18.69,9.87 18,10.55 18,15.18
PC7: length 22.5
  Top Layer w0.305: 18.5,15.18 18.5,11.15 19.04,10.61 26.59,10.61 27.14,11.16 27.14,12.2 27.55,12.61 33.95,12.61 34.27,12.93 H7.20
PC12: length 8.1
  Top Layer w0.305: U2.80 27.17,18.73 27.58,18.33 27.58,16.69 27.88,16.38 31.73,16.38
PD2: length 11.9
  Top Layer w0.305: H7.16 34.27,18.11 33.77,17.62 28.25,17.62 27.98,17.88 27.98,19.75 27.5,20.23 U2.83
PD8: length 23.8
  Top Layer w0.305: 14,15.18 14,9.37 14.52,8.85 31.64,8.85 31.73,8.76
PD9: length 26.8
  Top Layer w0.305: 34.27,11.3 34.27,10.52 33.75,10 28.97,10 28.24,9.26 14.88,9.26 14.5,9.63 14.5,15.18
PE0: length 11
  Top Layer w0.305: 34.27,26.54 34.27,26.09 33.44,25.26 30.85,25.26 30.46,25.65 30.46,26.8 30.02,27.23 U2.97
PE1: length 6.7
  Top Layer w0.305: U2.98 30.54,27.73 31.73,26.54
PE2: length 55.4
  Top Layer w0.305: H6.11 0.45,25.28 0.45,27.04 1.19,27.78 2.25,27.78 2.96,28.49 2.96,29.55 3.75,30.34 4.82,30.34 5.68,31.2 5.68,37.22 6.62,38.16 9.82,38.16 10.26,38.6 10.26,41.81 11.96,43.5 24.71,43.5 26.18,42.02 26.18,34.63 24,32.45 U2.1
PE3: length 52.4
  Top Layer w0.305: H6.12 3.79,24 2.91,24.88 2.91,27.14 3.55,27.78 4.59,27.78 6.09,29.27 6.09,36.61 6.9,37.43 10.25,37.43 10.94,38.11 10.94,41.46 12.34,42.86 24.55,42.86 25.7,41.72 25.7,35.45 23.5,33.25 U2.2
PE4: length 53.1
  Top Layer w0.305: U2.3 23,34.22 25.06,36.28 25.06,41.49 24.25,42.3 12.49,42.3 11.54,41.35 11.54,37.62 10.65,36.73 7.83,36.73 6.49,35.4 6.49,29.07 5.43,28 5.43,23.2 4.98,22.75 3.01,22.75 1.73,21.46
PE9: length 14.3
  Top Layer w0.305: 4.27,11.3 5.47,11.3 6.01,11.85 6.01,14.01 9.19,17.18 9.19,21.5 9.42,21.73 U2.40
RST: length 45.6
  Top Layer w0.305: U2.14 17.5,31.3 17.23,31.57 15.63,31.57 14.62,32.58 14.62,34.56 13.96,35.22 12.46,35.22 11.37,36.31 v1(11.24,36.31) ; R13.1 6.32,44.61 RESET.2 11.26,45.34 12.08,44.51 13.83,44.51 14.47,45.15 14.47,47 U22.9 ; R13.1 6.32,38.9 ; R13.1 C29.2 ; 6.32,38.9 3.5,38.9 3.06,38.47 3.06,35.37 H6.4 ; 6.32,38.9 v1(9.29,38.9)
  Bottom Layer w0.305: v1(9.29,38.9) 11.24,36.94 v1(11.24,36.31)
VREF+: length 3.3
  Top Layer w0.305: U2.21 14,31.34 v1(14.19,31.53)
  Bottom Layer w0.305: R4.1 12.7,31.53 v1(14.19,31.53)
VREF-: length 7.4
  Top Layer w0.305: v1(14.52,28.69) 14.52,30.26 U2.20
  Bottom Layer w0.305: C10.1 14.52,27.75 v1(14.52,28.69)
  Bottom Layer w0.508: R5.1 14.7,23.1 C10.1
$1N11352: length 2.8
  Top Layer w0.305: v1(23,16.47) 23,16.47 23,15.18
  Bottom Layer w0.305: v1(23,16.47) 22.09,17.39 C5.1
$1N11353: length 2.9
  Top Layer w0.305: v1(11.88,17.82) 11.29,17.23 U2.49
  Bottom Layer w0.305: v1(11.88,17.82) 12.62,18.56 C6.1
$1N11423: length 9.6
  Top Layer w0.254: X3.1 19.02,37.06 R7.2 19.26,34.95 C8.1 18.5,32.38 U2.12
$1N11424: length 9.6
  Top Layer w0.254: X3.2 17.51,37.04 17.51,33.41 C7.1 18,32.4 U2.13
$1N11440: length 10.6
  Top Layer w0.305: v1(18.36,7.51) 16.88,6.03 13.49,6.03 13.56,5.97 3V3.2
  Bottom Layer w0.305: v1(18.36,7.51) 23.11,7.51 R12.1
$1N11608: length 1.8
  Top Layer w1.27: LED2.2 R16.1
$1N16166: length 6
  Top Layer w0.508: R25.2 22.62,2.68 21.15,2.68 20.84,2.99 R21.1 20.82,3.98 20.82,5.09 21.22,5.5 R23.1
$1N16210: length 6.7
  Top Layer w0.508: R24.1 26.21,5.5 26.66,5.04 26.66,3.99 26.69,3.96 26.69,3.01 26.36,2.69 R26.2

## Copper pours and planes (outline as drawn; the poured copper is in the pictures)
3V3 on Top Layer: 9.08,3.31 14.55,3.31 14.55,0.32 9.08,0.32
GND on Top Layer: -2.55,52.11 37.74,52.11 37.74,-1.76 -2.55,-1.76
GND on Bottom Layer: -11.69,51.93 48.73,51.93 48.73,-0.98 -11.69,-0.98

Small or netless copper shapes (teardrops, artwork), in the pictures only: 138 on Top Layer, 135 on Bottom Layer

## Text on the board
Top Silkscreen Layer: PA5 | GND | PA0 | PA7 | 3V3 | PE2 | PE4 | PA2 | PA6 | PA3 | PE9 | RST | PE3 | PC1 | PA1 | PC12 | PA9 | PD8 | BT0 | PB5 | PC6 | PB9 | PB7 | PE1 | PA10 | PC7 | PE0 | PD9 | PB2 | PB8 | PB6 | PD2 | PB12 | BOOT0 | BOOT1 | 5V | UNLINE | LINE | 笨笨专用V1.0 / Designed By Point / 2025/2/5
